# Altium schematic sheet Sensor-Section.SchDoc
size A4; DocumentNumber: 7; SheetNumber: 7; SheetTotal: 8
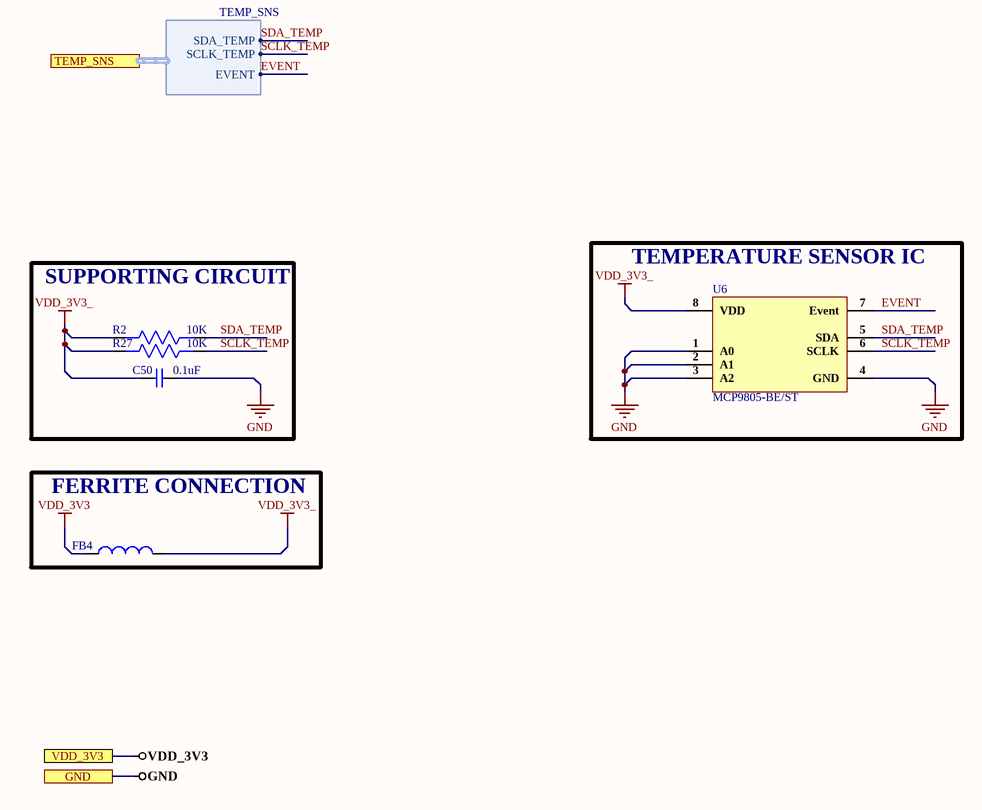
[diagram p0: Sensor-Section.SchDoc]

## Parts
C50  0.1uF  [Cap0603]
FB4  MPZ1608S121ATDH5  [MPZ1608S121ATDH5]  (value not drawn)
R2  10K  [Res0603]
R27  10K  [Res0603]
U6  MCP9805-BE/ST  [8-TSSOP]

## Blocks framed on the sheet
SUPPORTING CIRCUIT: C50 R2 R27
TEMPERATURE SENSOR IC: U6
FERRITE CONNECTION: FB4

## Ports
GND, TEMP_SNS (harness TEMP_SNS), VDD_3V3

## Harnesses
TEMP_SNS: EVENT, SDA_TEMP, SCLK_TEMP

## Nets
GND: C50.2 U6.1(A0) U6.2(A1) U6.3(A2) U6.4(GND) ; port GND
VDD_3V3: FB4.1 ; port VDD_3V3
VDD_3V3_: C50.1 FB4.2 R2.2 R27.2 U6.8(VDD)
EVENT: U6.7(Event) ; port TEMP_SNS.EVENT
SCLK_TEMP: R27.1 U6.6(SCLK) ; port TEMP_SNS.SCLK_TEMP
SDA_TEMP: R2.1 U6.5(SDA) ; port TEMP_SNS.SDA_TEMP

## Library data of the parts
C50 = CL10B104KB8NNNC: Cap Ceramic 0.1uF 50VDC X7R 10% SMD 0603 Paper T/R; Manufacturer: Samsung; Capacitance: 100nF; Voltage Rating: 50V; Supplier 1: Digi-Key; Manufacturer Part Number: CL10B104KB8NNNC; RoHS: Yes; Category: Ceramic Capacitors; Stock 1: 3998791; Pricing 1: 1=0.10000, 10=0.03000, 50=0.01640, 100=0.01340, 500=0.00954, 1000=0.00750 (USD); Mount: Surface Mount; Case/Package: 0603; Case Code (Metric): 1608; Case Code (Imperial): 0603; Material: Ceramic; Contact Plating: Tin; Min Operating Temperature: -55°C; Max Operating Temperature: 125°C; Dielectric: X7R; Tolerance: 10%; Package Quantity: 1; Packaging: Tape and Reel; Voltage: 50V; Voltage Rating (DC): 50V; Series: CL; Construction: Flat; Length: 1.6mm; Width: 0.031inch; Height: 0.8mm; Depth: 0.8mm; Thickness: 0.035inch; Radiation Hardening: No; Lead Free: Lead Free; RoHS Compliant: Yes; ComponentLink1URL: https://datasheet.ciiva.com/25803/cl10b104kb8nnnc-25803393.pdf?src-supplier=Digi-Key; ComponentLink1Description: https://datasheet.ciiva.com/25803/cl10b104kb8nnnc-25803393.pdf?src-supplier=Digi-Key; ComponentLink2URL: https://datasheet.ciiva.com/26838/getdatasheetpartid-89097-26838411.pdf?src-supplier=Verical; ComponentLink2Description: https://datasheet.ciiva.com/26838/getdatasheetpartid-89097-26838411.pdf?src-supplier=Verical; ComponentLink3URL: https://datasheet.ciiva.com/29198/456651-da-01-en-vs-kondensator-0605-29198839.pdf?src-supplier=Conrad; ComponentLink3Description: https://datasheet.ciiva.com/29198/456651-da-01-en-vs-kondensator-0605-29198839.pdf?src-supplier=Conrad; Supplier Part Number 1: 1276-1000-1-ND
FB4 = MPZ1608S121ATDH5: Ferrite Beads Multi-Layer 120Ohm 25% 100MHz 2A 45mOhm DCR 0603 Automotive T/R; Manufacturer: TDK; Number of Lines: 1; DC Resistance (DCR): 45mR; Impedance: 120R; Supplier 1: Digi-Key; Manufacturer Part Number: MPZ1608S121ATDH5; RoHS: Yes; Category: Ferrite Beads and Chips; Pricing 1: 1=0.11000, 10=0.08600, 25=0.07720, 50=0.05660, 100=0.04890, 250=0.03860, 500=0.03260, 1000=0.02746 (USD); Mount: Surface Mount; Case/Package: 0603; Case Code (Metric): 1608; Case Code (Imperial): 0603; Weight: 7.1E-05oz; Min Operating Temperature: -55°C; Max Operating Temperature: 125°C; Package Quantity: 4000; Packaging: Tape and Reel; Max Current Rating: 2A; Termination: SMD/SMT; Max DC Current: 2A; Tolerance: 25%; Test Frequency: 100MHz; Length: 0.063inch; Width: 0.031inch; Height: 0.03inch; Ratings: AEC-Q200; RoHS Compliant: Yes; ComponentLink1URL: https://media.digikey.com/pdf/Data%20Sheets/TDK%20PDFs/MPZ_Series_Br.pdf?src-supplier=Digi-Key; ComponentLink1Description: https://media.digikey.com/pdf/Data%20Sheets/TDK%20PDFs/MPZ_Series_Br.pdf?src-supplier=Digi-Key; ComponentLink2URL: http://www.mouser.com/ds/2/400/eads_commercial_power_mpz1608_en-923650.pdf?src-supplier=Mouser; ComponentLink2Description: http://www.mouser.com/ds/2/400/eads_commercial_power_mpz1608_en-923650.pdf?src-supplier=Mouser; ComponentLink3URL: https://product.tdk.com/info/en/catalog/datasheets/beads_automotive_power_mpz1608_en.pdf?src-supplier=Digi-Key; ComponentLink3Description: https://product.tdk.com/info/en/catalog/datasheets/beads_automotive_power_mpz1608_en.pdf?src-supplier=Digi-Key; Supplier Part Number 1: 445-172891-6-ND
R2 R27 = RC0603FR-0710KL: RES SMD 10K Ohm 1% 1/10W 0603; Manufacturer: Yageo; Resistance: 10kR; Temperature Coefficient: 100ppm/°C; Voltage Rating (DC): 50V; Power Rating: 100mW; Voltage Rating: 75V; Supplier 1: Digi-Key; Manufacturer Part Number: RC0603FR-0710KL; RoHS: Yes; Category: Chip SMD Resistors; Stock 1: 25249139; Pricing 1: 1=0.10000, 10=0.02400, 100=0.00970, 1000=0.00436, 2500=0.00378 (USD); Case/Package: 0603; Number of Pins: 2; Case Code (Imperial): 0603; Case Code (Metric): 1608; Weight: 7.1E-05oz; Size Code: 0603; Min Operating Temperature: -55°C; Max Operating Temperature: 155°C; Tolerance: 1%; Resistor Type: Thick Film; Packaging: Tape and Reel; Termination: SMD/SMT; Features: Moisture Resistant; Series: RC; Max Power Dissipation: 100mW; Number of Terminations: 2; Resistance Tolerance: 1%; Construction: Rectangular; Length: 1.6mm; Width: 0.8mm; Height: 0.45mm; Depth: 0.8mm; Lead Pitch: 0.3mm; REACH SVHC: Unknown; Lead Free: Lead Free; Military Standard: Not; RoHS Compliant: Yes; ComponentLink1URL: https://datasheet.ciiva.com/7660/38590-7660789.pdf?src-supplier=Element14; ComponentLink1Description: https://datasheet.ciiva.com/7660/38590-7660789.pdf?src-supplier=Element14; ComponentLink2URL: https://datasheet.ciiva.com/7983/443971-7983596.pdf?src-supplier=Element14; ComponentLink2Description: https://datasheet.ciiva.com/7983/443971-7983596.pdf?src-supplier=Element14; ComponentLink3URL: https://datasheet.ciiva.com/22747/443971-22747519.pdf?src-supplier=Element14; ComponentLink3Description: https://datasheet.ciiva.com/22747/443971-22747519.pdf?src-supplier=Element14; ComponentLink4URL: https://datasheet.ciiva.com/46440/1868787-46440891.pdf?src-supplier=Element14; ComponentLink4Description: https://datasheet.ciiva.com/46440/1868787-46440891.pdf?src-supplier=Element14; ComponentLink5URL: https://datasheet.ciiva.com/7746/1738695-7746239.pdf?src-supplier=Element14; ComponentLink5Description: https://datasheet.ciiva.com/7746/1738695-7746239.pdf?src-supplier=Element14; ComponentLink6URL: https://datasheet.ciiva.com/15189/getdatasheetpartid-409289-15189591.pdf?src-supplier=Verical; ComponentLink6Description: https://datasheet.ciiva.com/15189/getdatasheetpartid-409289-15189591.pdf?src-supplier=Verical; Supplier Part Number 1: 311-10.0KHRCT-ND
U6 = MCP9805-BE/ST: IC SENSOR THERMAL 3.0V 8TSSOP; Manufacturer: Microchip; Min Supply Voltage: 3V; Max Supply Voltage: 3.6V; Output Current: 1uA; Interface: I2C,SMBus,2-Wire,Serial; Resolution: 10b; Operating Supply Current: 200uA; Accuracy: 2%; Number of Bits: 10; Output Type: I2C,Digital; Sensor Type: Temperature; Sensing Method: Resistive; ComponentLink1URL: https://datasheet.ciiva.com/22737/1678782-22737270.pdf?src-supplier=Element14; ComponentLink1Description: https://datasheet.ciiva.com/22737/1678782-22737270.pdf?src-supplier=Element14; ComponentLink2URL: https://datasheet.ciiva.com/43467/1678782-43467032.pdf?src-supplier=Farnell; ComponentLink2Description: https://datasheet.ciiva.com/43467/1678782-43467032.pdf?src-supplier=Farnell; ComponentLink3URL: https://datasheet.ciiva.com/22673/1678782-22673662.pdf?src-supplier=Element14; ComponentLink3Description: https://datasheet.ciiva.com/22673/1678782-22673662.pdf?src-supplier=Element14; Supplier 1: Digi-Key; Manufacturer Part Number: MCP9805-BE/ST; RoHS: Yes; Category: Power Management ICs; Stock 1: 667; Pricing 1: 1=0.85000, 25=0.71000, 100=0.65000 (USD); Mount: Surface Mount; Case/Package: TSSOP; Number of Pins: 8; Min Operating Temperature: -40°C; Max Operating Temperature: 125°C; Package Quantity: 100; Packaging: Rail/Tube; Max Supply Voltage (DC): 3.6V; Min Supply Voltage (DC): 3V; Termination: SMD/SMT; Length: 3mm; Width: 4.4mm; Height: 1mm; Radiation Hardening: No; REACH SVHC: No SVHC; Lead Free: Lead Free; RoHS Compliant: Yes; ComponentLink4URL: https://datasheet.ciiva.com/1514/1791047-1514016.pdf?src-supplier=Element14; ComponentLink4Description: https://datasheet.ciiva.com/1514/1791047-1514016.pdf?src-supplier=Element14; ComponentLink5URL: https://datasheet.ciiva.com/2003/21977b-2003478.pdf?src-supplier=Digi-Key; ComponentLink5Description: https://datasheet.ciiva.com/2003/21977b-2003478.pdf?src-supplier=Digi-Key; ComponentLink6URL: https://datasheet.ciiva.com/5299/21977b-77986-5299688.pdf?src-supplier=Mouser; ComponentLink6Description: https://datasheet.ciiva.com/5299/21977b-77986-5299688.pdf?src-supplier=Mouser; ComponentLink7URL: https://datasheet.ciiva.com/3279/21977b-3279902.pdf?src-supplier=Avnet; ComponentLink7Description: https://datasheet.ciiva.com/3279/21977b-3279902.pdf?src-supplier=Avnet; Supplier Part Number 1: MCP9805-BE/ST-ND